# EAGLE schematic rat2 (EAGLE 7.5.0)
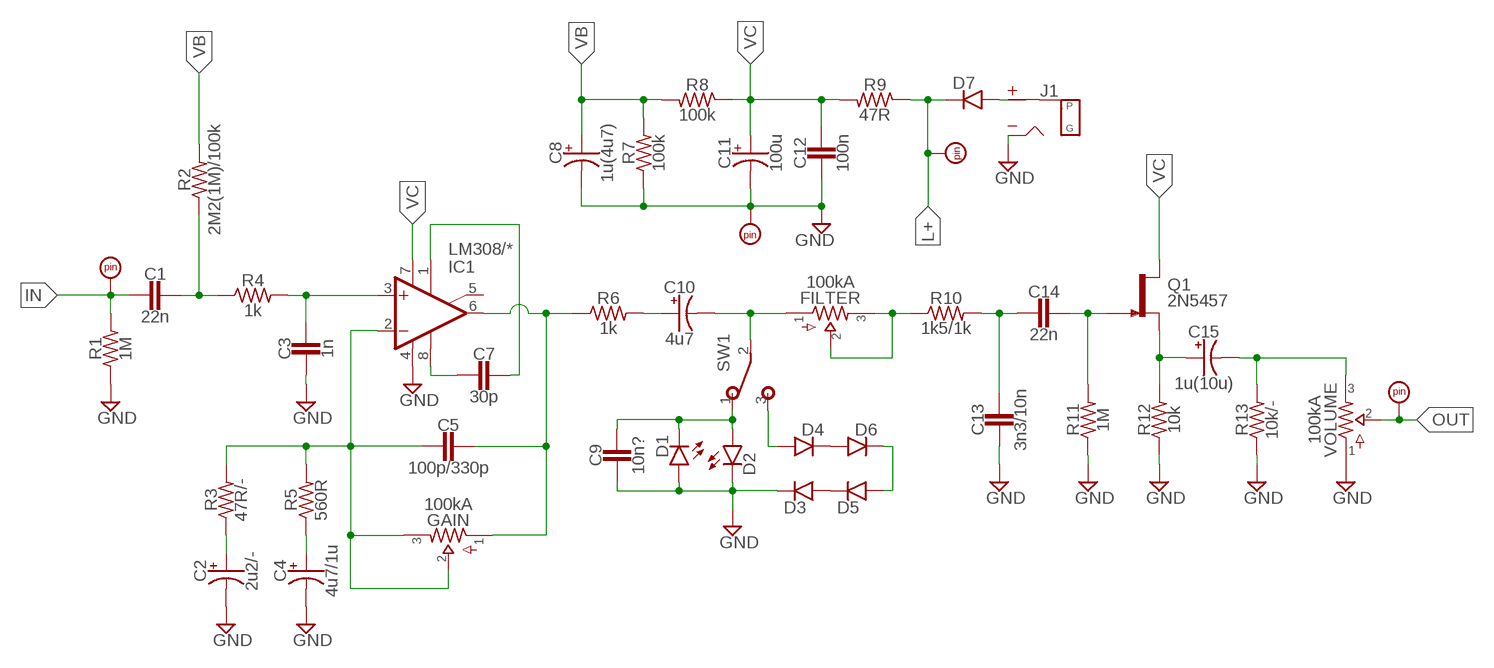
[diagram p0: schematic, sheet 1]

## Parts
C1  22n  CER/FILM2  [050X030_025_2]
C2  2u2/-  0501  [050_020_1]
C3  1n  CER/FILM2  [050X030_025_2]
C4  4u7/1u  0501  [050_020_1]
C5  100p/330p  CER/FILM2  [050X030_025_2]
C7  30p  CER/FILM2  [050X030_025_2]
C8  1u(4u7)  0501  [050_020_1]
C9  10n?  CER/FILM2  [050X030_025_2]
C10  4u7  0501  [050_020_1]
C11  100u  0501  [050_020_1]
C12  100n  CER/FILM2  [050X030_025_2]
C13  3n3/10n  CER/FILM2  [050X030_025_2]
C14  22n  CER/FILM2  [050X030_025_2]
C15  1u(10u)  0501  [050_020_1]
D1  LEDB  [3MM_B]
D2  LEDB  [3MM_B]
D3  DO35.3  [DO35-3]
D4  DO35.3  [DO35-3]
D5  DO35.3  [DO35-3]
D6  DO35.3  [DO35-3]
D7  DO41.3  [DO41-3]
FILTER  100kA  POTS16MM  [16MM]
GAIN  100kA  POTS16MM  [16MM]
IC1  LM308/*  SINGLETH  [DIL08]
J1  DC_MONO  [DC]
PAD1  PADSQR  [SQUARE]
PAD2  PADRND  [ROUND]
PAD3  PADSQR  [SQUARE]
PAD4  PADSQR  [SQUARE]
Q1  2N5457  [TO92-]
R1  1M  R_.3B  [R0207/3]
R2  2M2(1M)/100k  R_.3B  [R0207/3]
R3  47R/-  R_.3B  [R0207/3]
R4  1k  R_.3B  [R0207/3]
R5  560R  R_.3B  [R0207/3]
R6  1k  R_.3B  [R0207/3]
R7  100k  R_.3B  [R0207/3]
R8  100k  R_.3B  [R0207/3]
R9  47R  R_.3B  [R0207/3]
R10  1k5/1k  R_.3B  [R0207/3]
R11  1M  R_.3B  [R0207/3]
R12  10k  R_.3B  [R0207/3]
R13  10k/-  R_.3B  [R0207/3]
SW1  SPDT  [M9040P]
VOLUME  100kA  POTS16MM  [16MM]

## Nets
GND: C2.- C3.2 C4.- C8.- C9.2 C11.- C12.2 C13.2 D1.A D2.K(C) D3.C IC1.4(V-) J1.S(SLEEVE) PAD2.1 R1.1 R7.1 R11.1 R12.1 R13.1 VOLUME.1
IN: C1.2 PAD1.1 R1.2
L+: D7.C PAD3.1 R9.1
N$1: C9.1 D1.K(C) D2.A SW1.1(O)
N$2: C1.1 R2.1 R4.1
N$3: D4.A SW1.3(S)
N$4: C3.1 IC1.3(+IN) R4.2
N$5: C5.2 GAIN.2 GAIN.3 IC1.2(-IN) R3.2 R5.2
N$6: C5.1 GAIN.1 IC1.6(OUT) R6.1
N$7: C10.+ R6.2
N$8: C10.- FILTER.1 SW1.2(P)
N$9: FILTER.2 FILTER.3 R10.1
N$10: C13.1 C14.2 R10.2
N$11: C14.1 Q1.1(G) R11.2
N$12: C15.+ Q1.2(S) R12.2
N$13: C15.- R13.2 VOLUME.3
N$14: D4.C D6.A
N$15: C7.2 IC1.8(OPT)
N$16: C7.1 IC1.1(ON1)
N$17: C2.+ R3.1
N$18: C4.+ R5.1
N$19: D7.A J1.T(TIP)
N$20: D3.A D5.C
N$21: D5.A D6.C
OUT: PAD4.1 VOLUME.2
VB: C8.+ R2.2 R7.2 R8.2
VC: C11.+ C12.1 IC1.7(V+) Q1.3(D) R8.1 R9.2
Unconnected: IC1.5(ON2)

## Library data of the parts
C1 C3 C5 C7 C9 C12-C14 = capacitors-film:CER/FILM: 47 - 120pF Xicon Ceramic Disc 2.5mm lead spacing
C2 C4 C8 C10 C11 C15 = capacitors-elec:050: 0.22 - 100uF Xicon values at Mouser.com: 10V: 10 - 100uF; 16V: 2.2 - 47uF; 25V: 0.47 - 47uF; 50V: 0.22 - 22uF
D1 D2 = diodes:LED
D3-D6 = diodes:DO35: DO-35 Package Diodes: 1N914
D7 = diodes:DO41: DO-41 Package Diodes: 1N4001 - 1N40019 Zener Diodes: 1N4728 - 1N4764
FILTER GAIN VOLUME = potentiometers:POTS
IC1 = integrated circuits:SINGLE: OP AMP
J1 = jacks:DC_MONO
PAD1-PAD4 = supply pins:PAD
Q1 = transistors:2N5457: N-CHANNEL JFET
R1-R13 = resistors:R_
SW1 = switches:SPDT: TOGGLE SWITCH Marquardt